# Altium schematic sheet Power.SchDoc
size A3; SheetNumber: 5; SheetTotal: 5
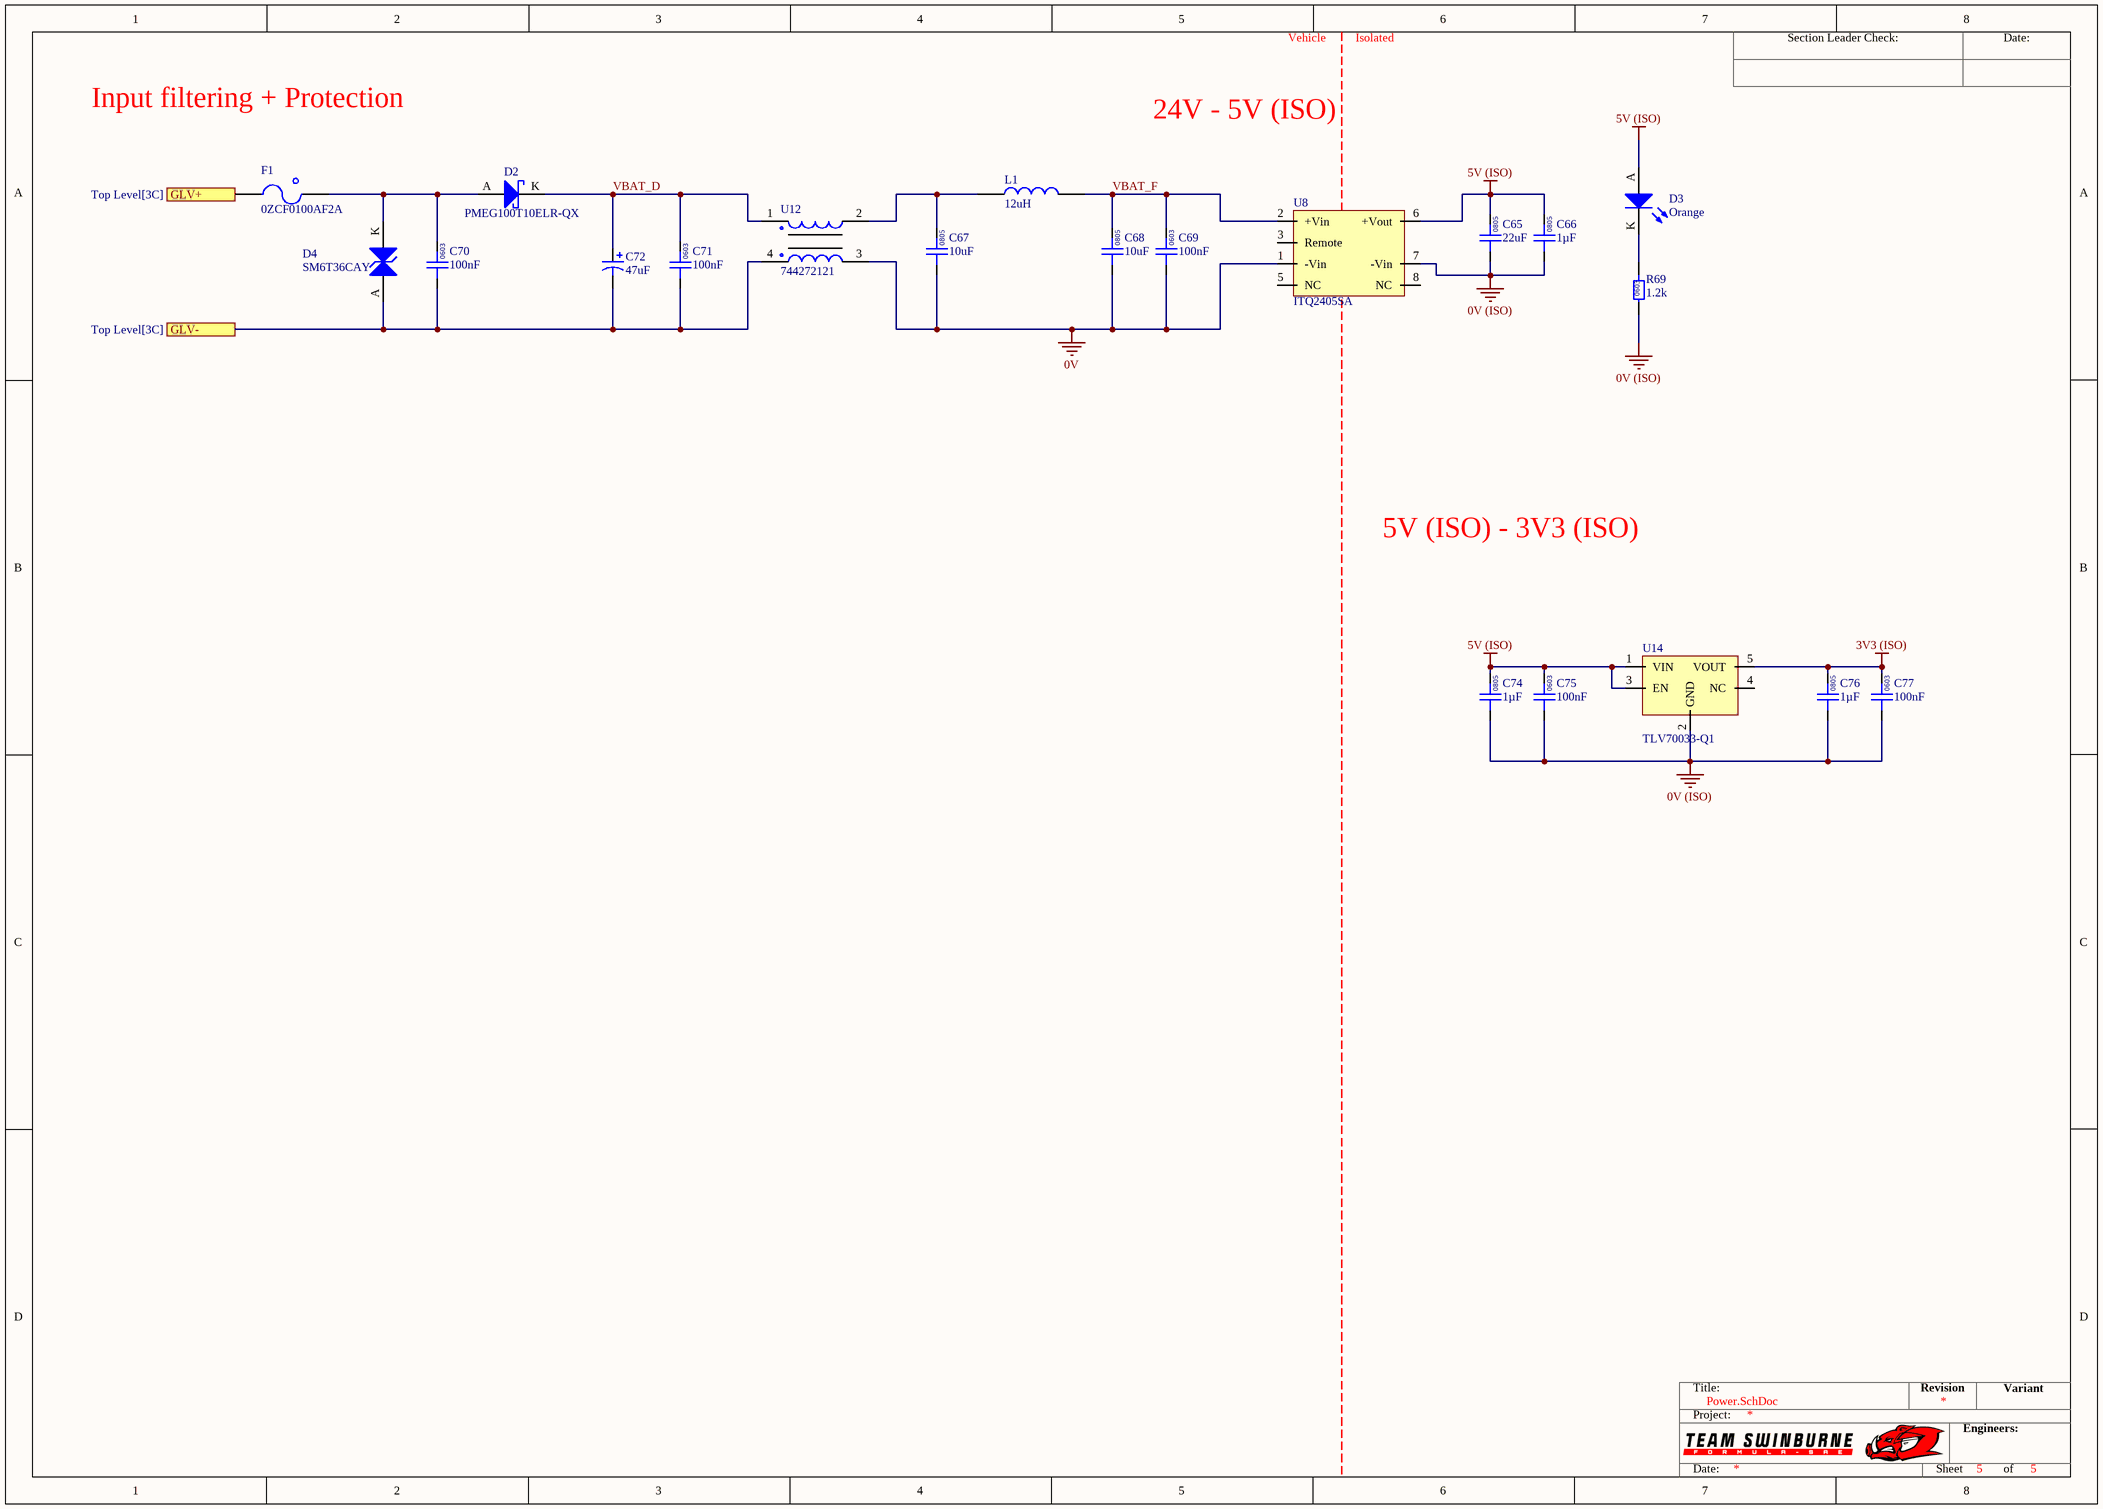
[diagram p0: Power.SchDoc]

## Parts
C65  22uF  [0805]
C66  1µF  [0805]
C67  10uF  [0805]
C68  10uF  [0805]
C69  100nF  [0603]
C70  100nF  [0603]
C71  100nF  [0603]
C72  47uF  [CHEMI-CON ELCO]
C74  1µF  [0805]
C75  100nF  [0603]
C76  1µF  [0805]
C77  100nF  [0603]
D2  PMEG100T10ELR-QX  [NXP SOD123W]
D3  Orange  [0805 LED]
D4  SM6T36CAY  [ST SMB DIODE]
F1  0ZCF0100AF2A  [2920]
L1  12uH  [1812]
R69  1.2k  [0603]
U8  ITQ2405SA  [8-SIP]
U12  744272121  [Wurth 4-PC Pad]
U14  TLV70033-Q1  [TI SOT-23-5]

## Ports
GLV+ (see Top Level[3C]), GLV- (see Top Level[3C])

## Nets
0V: C67.1 C68.1 C69.1 U8.1(-Vin) U12.3
0V (ISO): C65.1 C66.1 C74.1 C75.1 C76.1 C77.1 R69.1 U8.7(-Vin) U14.2(GND)
3V3 (ISO): C76.2 C77.2 U14.5(VOUT)
5V (ISO): C65.2 C66.2 C74.2 C75.2 D3.A U8.6(+Vout) U14.1(VIN) U14.3(EN)
GLV+: F1.1 ; port GLV+
GLV-: C70.1 C71.1 C72.1 D4.A U12.4 ; port GLV-
VBAT_D: C71.2 C72.2 D2.K U12.1
VBAT_F: C68.2 C69.2 L1.1 U8.2(+Vin)
NetC67_2: C67.2 L1.2 U12.2
NetC70_2: C70.2 D2.A D4.K F1.2
NetD3_K: D3.K R69.2

Not connected (* = marked no-connect by the designer): U8 3(Remote) 5(NC) 8(NC); U14 4(NC)

## Notes on the sheet
- Vehicle
- Isolated
- Input filtering + Protection
- 24V - 5V (ISO)
- 5V (ISO) - 3V3 (ISO)
- Section Leader Check:
- Date:
- Title:
- Revision
- Variant
- Project:
- Engineers:
- Sheet
- of
- (in symbol GCM21BR71H105KA03L) 0805
- (in symbol GCM188L81H104KA57D) 0603
- (in symbol GRM21BR6YA106KE43L) 0805
- (in symbol GRM21BR61A226ME51L) 0805
- (in symbol RC0603JR-071K2L) 0603

## Library data of the parts
C65 = GRM21BR61A226ME51L: Manufacturer: muRata; Rated Voltage: 10V; Tolerance: 20%; Material: MLCC; Temperature Rating: X5R; Part Number: GRM21BR61A226ME51L; Value: 22uF; Digikey Part Number: 490-10511-1-ND
C66 C74 C76 = GCM21BR71H105KA03L: Manufacturer: muRata; Rated Voltage: 50V; Tolerance: ±10%; Material: MLCC; Temperature Rating: X7R; Part Number: GCM21BR71H105KA03L; Value: 1µF; Digikey Part Number: 490-10675-1-ND
C67 C68 = GRM21BR6YA106KE43L: Manufacturer: muRata; Rated Voltage: 50V; Tolerance: 10%; Material: MLCC; Temperature Rating: X5R; Part Number: GRM21BR6YA106KE43L; Value: 10uF; Digikey Part Number: 490-10514-6-ND
C69-C71 C75 C77 = GCM188L81H104KA57D: Manufacturer: muRata; Rated Voltage: 50V; Tolerance: ±10%; Material: MLCC; Temperature Rating: X8L; Part Number: GCM188L81H104KA57D; Value: 100nF; Digikey Part Number: 490-6049-1-ND
C72 = HHXA350ARA470MF61G: Manufacturer: Chemi-Con; Rated Voltage: 35V; Tolerance: 20%; Material: Aluminium Electrolytic; Temperature Rating: 125C; Part Number: HHXA350ARA470MF61G; Value: 47uF
D2 = PMEG100T10ELR-QX: Manufacturer: Nexperia USA Inc.; Forward Voltage: 0.75 V @ 1A; Breakdown Voltage: 100 V; Rated Power: 680 mW; Part Number: PMEG100T10ELR-QX; Digikey Part Number: 1727-PMEG100T10ELR-QXCT-ND
D3 = SML-211DTT86: Orange LED Indication - Discrete 1.75V 0805 (2012 Metric); Manufacturer: ROHM Semiconductor; Part Number: SML-211DTT86; Colour: Orange; Digikey Part Number: 511-1291-1-ND
D4 = SM6T36CAY: Manufacturer: STMicroelectronics; Forward Voltage: 30.8 V; Rated Power: 600W; Part Number: SM6T36CAY; Breakdown Voltage: 30.8 V; Digikey Part Number: 497-10804-1-ND
F1 = 0ZCF0100AF2A: PTC RESET FUSE 60V 1A 292; Manufacturer: Littelfuse Inc.; Part Number: 0ZCF0100AF2A; Digikey Part Number: 507-2070-1-ND; Digikey Link: https://www.digikey.com/product-detail/en/bel-fuse-inc/0ZCF0100AF2A/507-2070-1-ND/6210547
L1 = RLS-126: Manufacturer: Recom; Tolerance: 0.2; Impedance: 230mOhm; Rated Current: 0.8 A; Material: Wirewound; Part Number: RLS-126; Value: 12uH; Digikey Part Number: 945-3429-ND
R69 = RC0603JR-071K2L: Manufacturer: YAGEO; Tolerance: 0.01; Rated Power: 0.1W; Part Number: RC0603JR-071K2L; Value: 1.2k; Material: FR-07; Digikey Part Number: 311-1.2KGRCT-ND
U8 = ITQ2405SA: DC DC CONVERTER 5V 6W; Manufacturer: XP Power; Input Voltage: 9 to 36 V; Output Current: 1.2 A; Part Number: ITQ2405SA; Output Voltage: 5 V; Digikey Part Number: 1470-2858-5-ND
U12 = 744272121: Manufacturer: Wurth Electronics Inc; Value: 120uH @ 100kHz; Impedance: 460 Ohms @ 30MHz; Rated Current: 2.5 A; Part Number: 744272121; Material: Wirewound; Digikey Part Number: 732-1489-1-ND
U14 = TLV70033-Q1: IC REG LINEAR 3.3V 200MA SOT23-5; Manufacturer: Texas Instruments; Input Voltage: 2 to 5.5 V; Output Current: 0.2 A; Part Number: TLV70033-Q1; Output Voltage: 3.3 V; Digikey Part Number: 296-27780-1-ND